# Altium project EE4216_LAB2.PrjPcb
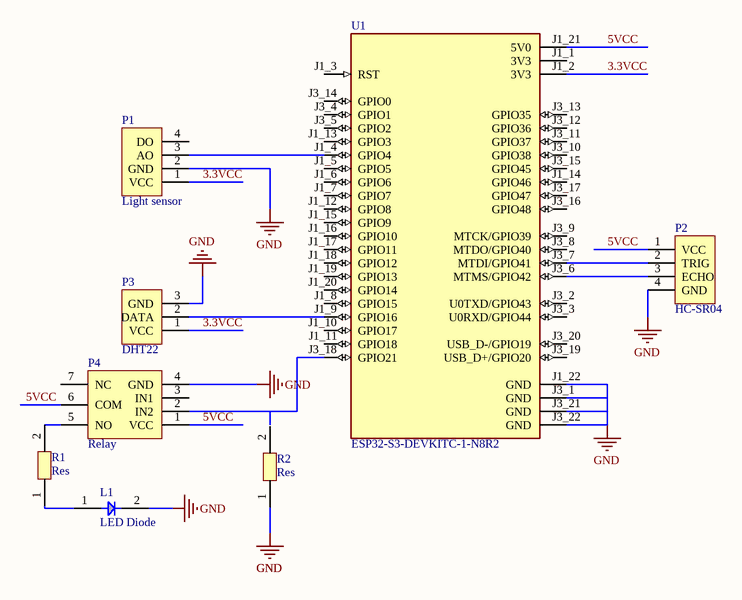
[diagram p0: Schematic.SchDoc]
1 sheet, 8 parts. Net scope: global (net labels, ports and power ports of the same name join across sheets).

## Sheet Schematic.SchDoc
size A4; SheetNumber: 1; SheetTotal: 1

### Parts
L1  LED Diode
P1  Light sensor
P2  HC-SR04
P3  DHT22
P4  Relay
R1  Res
R2  Res
U1  ESP32-S3-DEVKITC-1-N8R2  [XCVR_ESP32-S3-DEVKITC-1-N8R2]

### Nets

Not connected (* = marked no-connect by the designer): L1 1 2; P1 1(VCC) 2(GND) 3(AO) 4(DO); P2 1(VCC) 2(TRIG) 3(ECHO) 4(GND); P3 1(VCC) 2(DATA) 3(GND); P4 1(VCC) 2(IN2) 3(IN1) 4(GND) 5(NO) 6(COM) 7(NC); R1 1 2; R2 1 2; U1 J1_1(3V3) J1_2(3V3) J1_3(RST) J1_4(GPIO4) J1_5(GPIO5) J1_6(GPIO6) J1_7(GPIO7) J1_8(GPIO15) J1_9(GPIO16) J1_10(GPIO17) J1_11(GPIO18) J1_12(GPIO8) J1_13(GPIO3) J1_14(GPIO46) J1_15(GPIO9) J1_16(GPIO10) J1_17(GPIO11) J1_18(GPIO12) J1_19(GPIO13) J1_20(GPIO14) J1_21(5V0) J1_22(GND) J3_1(GND) J3_2(U0TXD/GPIO43) J3_3(U0RXD/GPIO44) J3_4(GPIO1) J3_5(GPIO2) J3_6(MTMS/GPIO42) J3_7(MTDI/GPIO41) J3_8(MTDO/GPIO40) J3_9(MTCK/GPIO39) J3_10(GPIO38) J3_11(GPIO37) J3_12(GPIO36) J3_13(GPIO35) J3_14(GPIO0) J3_15(GPIO45) J3_16(GPIO48) J3_17(GPIO47) J3_18(GPIO21) J3_19(USB_D+/GPIO20) J3_20(USB_D-/GPIO19) J3_21(GND) J3_22(GND)

### Notes on the sheet
- Labels drawn without touching a wire or pin: 3.3VCC, 5VCC, GND

### Library data of the parts
P1 = Light Sensor Module
P2 = HC-SR04: Ultrasonic sensor
U1 = ESP32-S3-DEVKITC-1-N8R2: WiFi Development Tools - 802.11 (Engineering Samples Only) ESP32-S3 General-Purpose Development Board, ESP32-S3-WROOM-1-N8R2, with Pin Header; MF: Espressif Systems; SnapEDA_Link: https://www.snapeda.com/parts/ESP32-S3-DEVKITC-1-N8R2/Espressif+Systems/view-part/?ref=snap; Package: None; Value: *; MP: ESP32-S3-DEVKITC-1-N8R2; Check_prices: https://www.snapeda.com/parts/ESP32-S3-DEVKITC-1-N8R2/Espressif+Systems/view-part/?ref=eda